# EAGLE design msnanopcb (EAGLE 7.7.0)
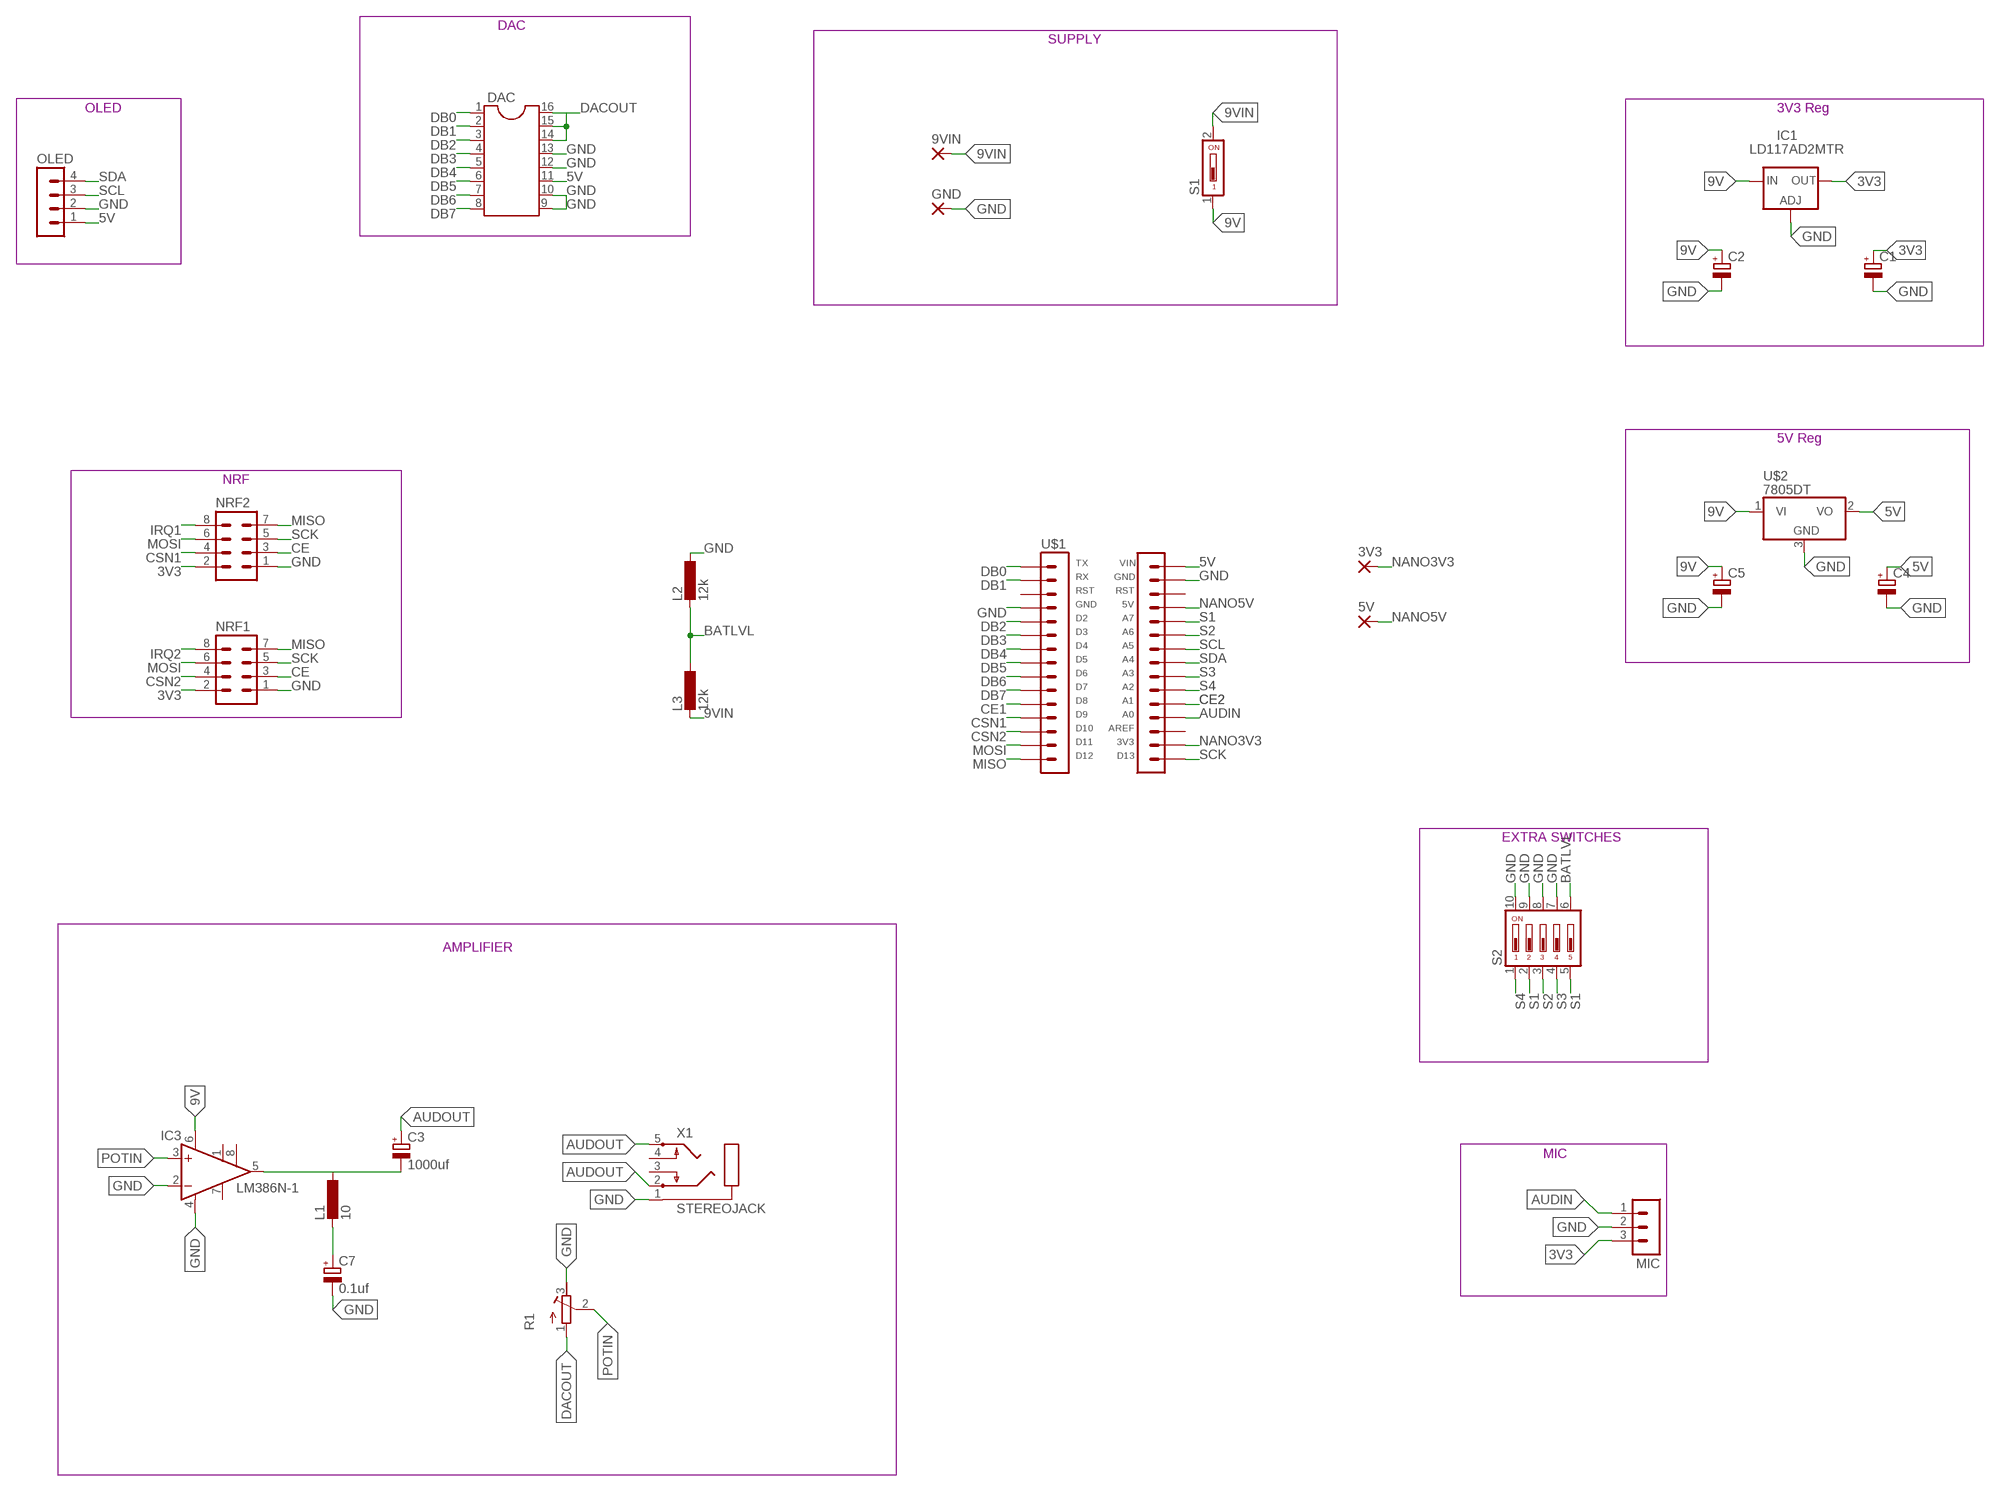
[diagram p0: schematic, sheet 1]

## Parts
3V3  WIREPADSMD1,27-254  [SMD1,27-2,54]
5V  WIREPADSMD1,27-254  [SMD1,27-2,54]
9VIN  WIREPADSMD1,27-254  [SMD1,27-2,54]
C1  CPOL-EUE2,5-6E  [E2,5-6E]
C2  CPOL-EUE2,5-6E  [E2,5-6E]
C3  1000uf  CPOL-EUE3.5-8  [E3,5-8]
C4  CPOL-EUE2,5-6E  [E2,5-6E]
C5  CPOL-EUE2,5-6E  [E2,5-6E]
C7  0.1uf  CPOL-EUE2-5  [E2-5]
DAC  DIL16S  [SOCKET-16]
GND  WIREPADSMD1,27-254  [SMD1,27-2,54]
IC1  LD117AD2MTR  [D2PACK]
IC3  LM386N-1  [DIL08]
L1  10  L-EU0204/7  [0204/7]
L2  12k  L-EU0204/7  [0204/7]
L3  12k  L-EU0204/7  [0204/7]
MIC  MA03-1  [MA03-1]
NRF1  MA04-2  [MA04-2]
NRF2  MA04-2  [MA04-2]
OLED  MA04-1  [MA04-1]
R1  R-TRIMM3296P  [RTRIM3296P]
S1  DS01  [DS-01]
S2  DS05  [DS-05]
U$1  ARD-NANO  [ARD-NANO]
U$2  7805DT  [TO252]
X1  STEREOJACK  [STX3100]

## Nets
3V3: C1.+ IC1.2(OUT) MIC.3 NRF1.2 NRF2.2
5V: C4.+ DAC.11 OLED.1 U$1.VIN U$2.2(VO)
9V: C2.+ C5.+ IC1.3(IN) IC3.6(VS) S1.1 U$2.1(VI)
9VIN: 9VIN.1(P) L3.2 S1.2
AUDIN: MIC.1 U$1.A0
AUDOUT: C3.+ X1.2 X1.5
BATLVL: L2.2 L3.1 S2.6
CE: NRF1.3 NRF2.3
CE1: U$1.D8
CE2: U$1.A1
CSN1: NRF2.4 U$1.D9
CSN2: NRF1.4 U$1.D10
DACOUT: DAC.14 DAC.15 DAC.16 R1.1(A)
DB0: DAC.1 U$1.TX
DB1: DAC.2 U$1.RX
DB2: DAC.3 U$1.D2
DB3: DAC.4 U$1.D3
DB4: DAC.5 U$1.D4
DB5: DAC.6 U$1.D5
DB6: DAC.7 U$1.D6
DB7: DAC.8 U$1.D7
GND: C1.- C2.- C4.- C5.- C7.- DAC.9 DAC.10 DAC.12 DAC.13 GND.1(P) IC1.1(ADJ) IC3.2(-IN) IC3.4(GND) L2.1 MIC.2 NRF1.1 NRF2.1 OLED.2 R1.3(E) S2.7 S2.8 S2.9 S2.10 U$1.GND1 U$1.GND2 U$2.3(GND) X1.1
IRQ1: NRF2.8
IRQ2: NRF1.8
MISO: NRF1.7 NRF2.7 U$1.D12
MOSI: NRF1.6 NRF2.6 U$1.D11
N$4: C3.- IC3.5(OUT) L1.1
N$9: C7.+ L1.2
NANO3V3: 3V3.1(P) U$1.3V3
NANO5V: 5V.1(P) U$1.5V
POTIN: IC3.3(+IN) R1.2(S)
S1: S2.2 S2.5 U$1.A7
S2: S2.3 U$1.A6
S3: S2.4 U$1.A3
S4: S2.1 U$1.A2
SCK: NRF1.5 NRF2.5 U$1.D13
SCL: OLED.3 U$1.A5
SDA: OLED.4 U$1.A4
Unconnected: IC3.1(GAIN) IC3.7(BYPASS) IC3.8(GAIN) U$1.AREF U$1.RST1 U$1.RST2 X1.3 X1.4

## Notes on the sheet
- DAC
- SUPPLY
- OLED | 3V3 Reg
- 5V Reg
- NRF
- EXTRA SWITCHES
- AMPLIFIER
- MIC

## Library data of the parts
3V3 5V 9VIN GND = wirepad:WIREPAD: Wire PAD connect wire on PCB
C1-C5 C7 = rcl:CPOL-EU: POLARIZED CAPACITOR, European symbol
DAC = ic-package:DIL16: Dual In Line / Socket
IC1 = v-reg:LD117A?*: Low drop fixed and adjustable positive voltage regulators 1 A Source: http://www.st.com/stonline/products/literature/ds/7194/ld1117axx.pdf
IC3 = linear:LM386?-*: Low Voltage Audio Power Amplifier Source: http://cache.national.com/ds/LM/LM386.pdf
L1-L3 = rcl:L-EU: INDUCTOR, European symbol
MIC = 00-con-lstb_edited:MA03-1: PIN HEADER; OC_FARNELL: unknown; OC_NEWARK: unknown
NRF1 NRF2 = con-lstb:MA04-2: PIN HEADER; OC_FARNELL: unknown; OC_NEWARK: unknown
OLED = con-lstb:MA04-1: PIN HEADER; OC_FARNELL: unknown; OC_NEWARK: unknown
R1 = rcl:R-TRIMM: Trimm resistor
S1 = switch-dil:DS01: DIL/CODE SWITCH; OC_FARNELL: unknown; OC_NEWARK: unknown
S2 = switch-dil:DS05: DIL/CODE SWITCH; OC_FARNELL: 1255225; OC_NEWARK: unknown
U$1 = #rcn-15:ARD-NANO
U$2 = adafruit:78*: Positive VOLTAGE REGULATOR Added bigger pads to the TO-92 package
X1 = adafruit:STEREOJACK: MIC/HEADPHONE JACK Stereo jack with two switches. Kycon STX3100, CUI SJ1-3555NG and/or 4UCon 05544

## Board
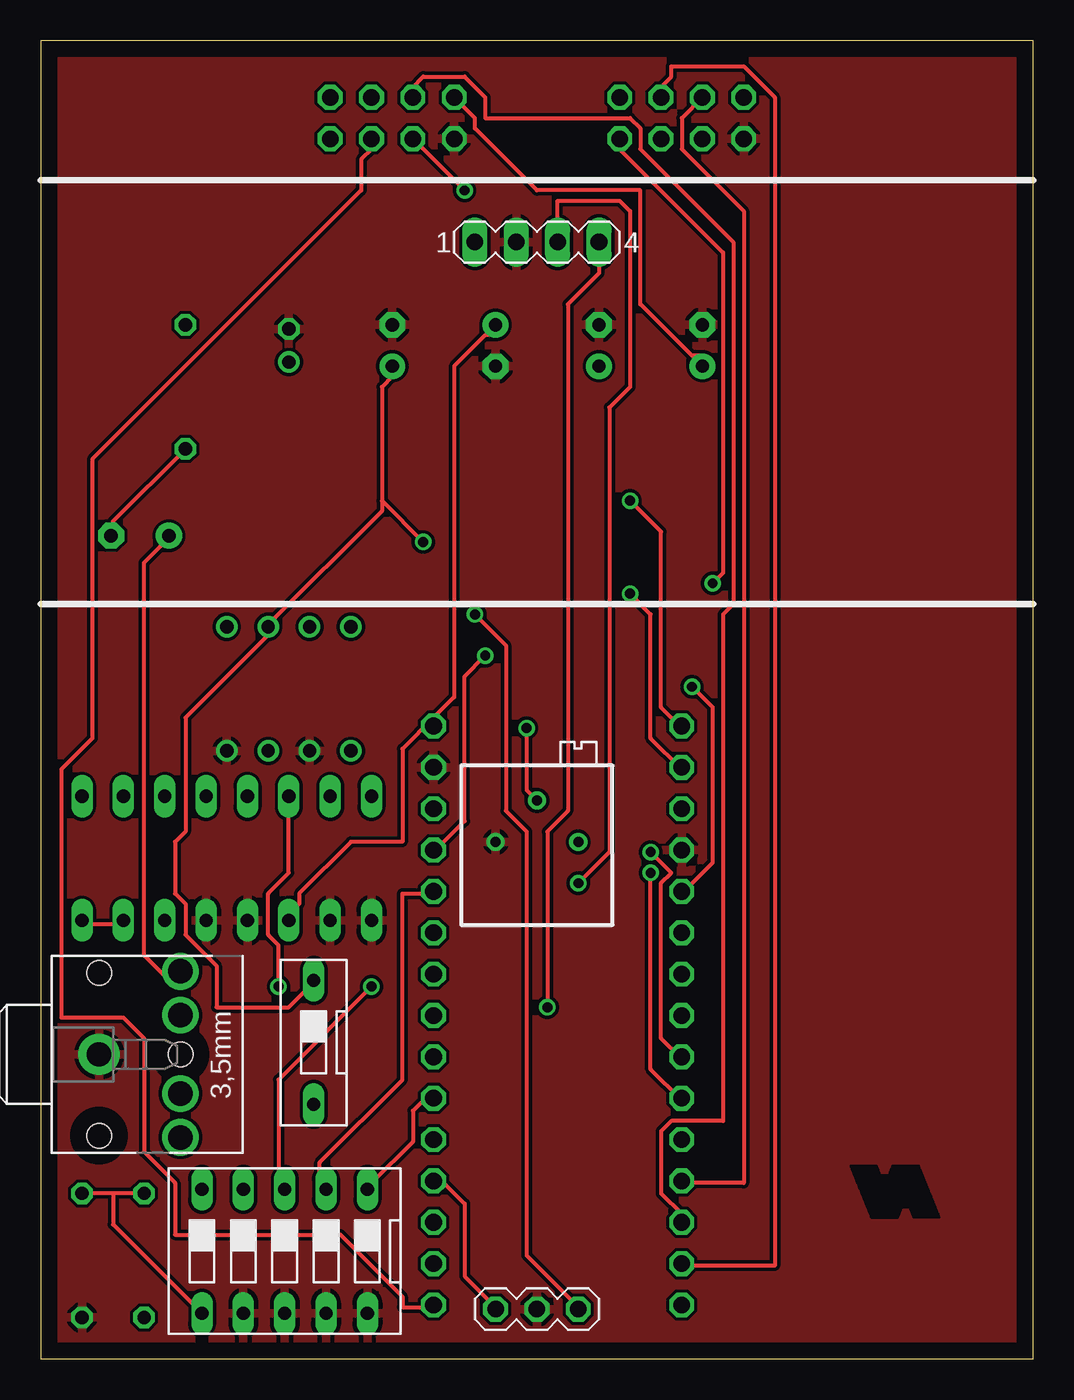
[diagram p1: board, top side]
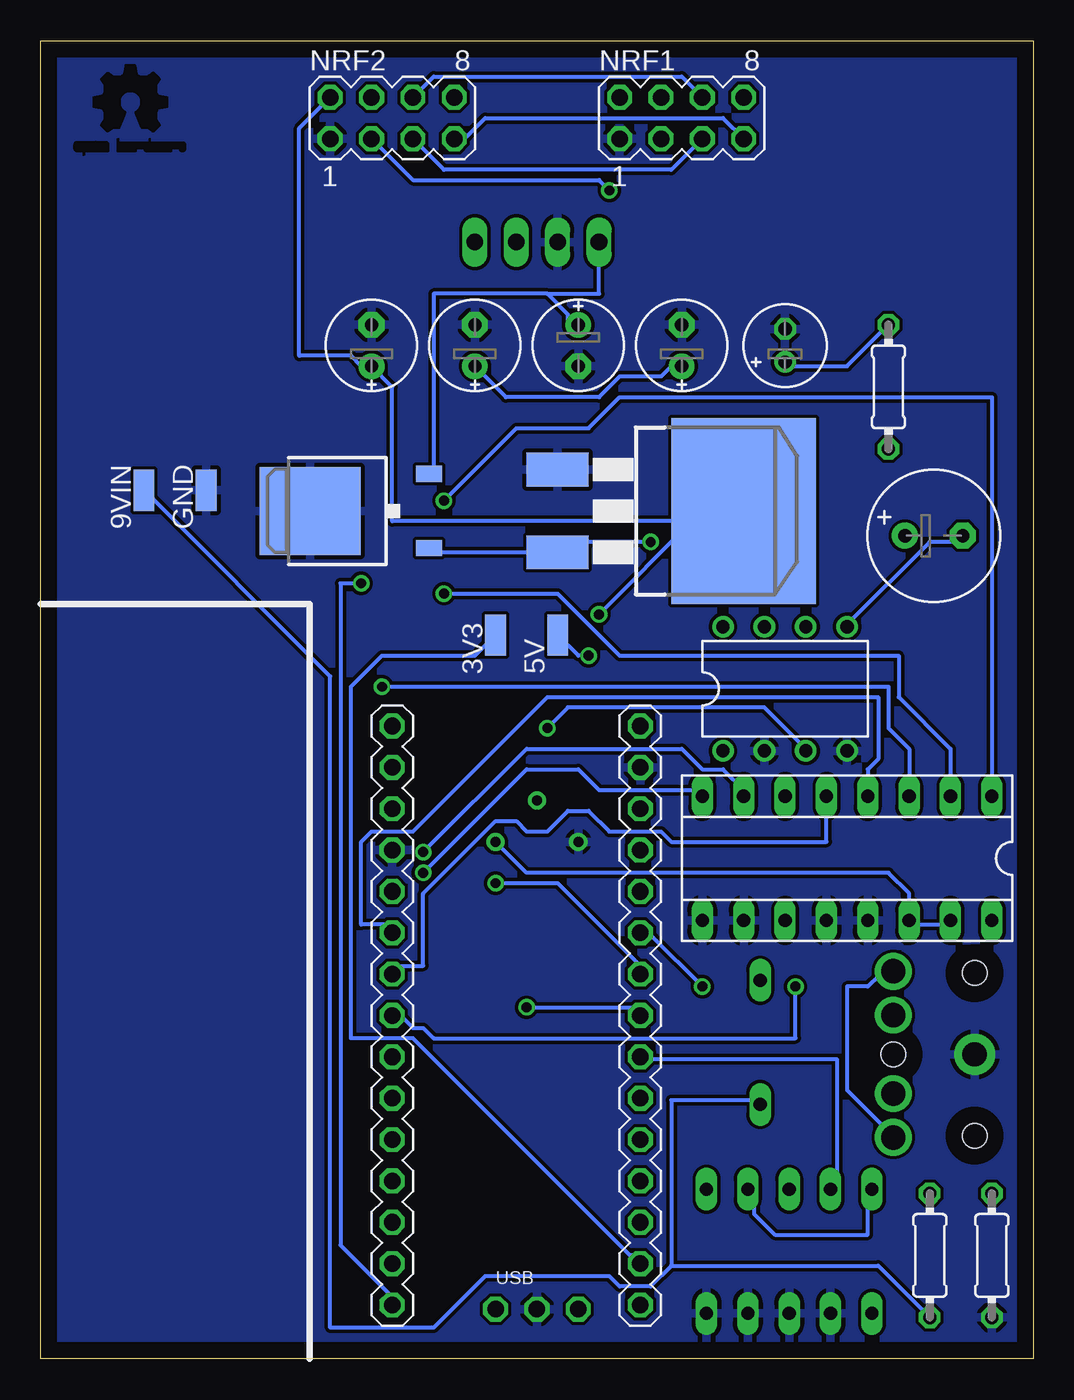
[diagram p2: board, bottom side, seen from below]

Size 60.96 x 80.95 mm. Coordinates in mm from the lower left corner, seen from the top.
Outline: 0,0 60.96,0 60.96,80.95 0,80.95 0,0
Copper layers (1*16): Top 0.035mm / dielectric 1.5mm / Bottom 0.035mm
Design rules "default": minimum track width 10mil, minimum drill 24mil, track to track 8mil, track to pad 8mil, pad to pad 8mil, via to via 8mil, smd to smd 8mil, copper to edge 40mil, drill to drill 8mil, minimum pad ring 10mil, minimum via ring 8mil, stop-mask expansion 4mil, vias tented up to drill 0mil, thermal gap 10mil
tRestrict: area 55.2,8.6 to 55.3,8.7; area 55.2,8.6 to 55.2,8.8; area 55.2,8.6 to 55.2,8.9; area 55.2,8.6 to 55.2,8.9; area 55.1,8.6 to 55.2,9; area 55.1,8.6 to 55.1,9; area 55.1,8.6 to 55.1,9.1; area 55.1,8.6 to 55.1,9.2; area 55,8.6 to 55.1,9.2; area 55,8.6 to 55,8.8; area 55,8.8 to 55,9.3; area 55,8.6 to 55,8.8; 484 more areas
bRestrict: area 58.3,73.9 to 58.4,73.9; area 58.3,73.9 to 58.4,73.9; area 58.3,73.9 to 58.4,73.9; area 58.3,73.9 to 58.4,73.9; area 58.3,73.9 to 58.4,73.9; area 58.3,73.9 to 58.4,73.9; area 58.3,73.9 to 58.4,73.9; area 58.3,73.9 to 58.4,73.9; area 58.3,73.9 to 58.4,73.9; area 58.3,73.9 to 58.4,73.9; area 58.3,73.9 to 58.4,73.9; area 58.3,73.9 to 58.4,73.9; 7412 more areas

### Footprints (pad centres in the part's own frame; a part is rotated, then mirrored left to right if it is on the bottom)
SMD1,27-2,54 = smd 1.27 x 2.54: 1 0,0
E2,5-6E = drill 0.813 pad 1.575: + -1.27,0 | drill 0.813 pad 1.575 octagon: - 1.27,0
E3,5-8 = drill 0.813 pad 1.6: + -1.778,0 | drill 0.813 pad 1.6 octagon: - 1.778,0
E2-5 = drill 0.813 pad 1.27: + -1.016,0 | drill 0.813 pad 1.27 octagon: - 1.016,0
SOCKET-16 = drill 0.813 long: 1 -8.89,-3.81; 2 -6.35,-3.81; 3 -3.81,-3.81; 4 -1.27,-3.81; 5 1.27,-3.81; 6 3.81,-3.81; 7 6.35,-3.81; 8 8.89,-3.81; 9 8.89,3.81; 10 6.35,3.81; 11 3.81,3.81; 12 1.27,3.81; 13 -1.27,3.81; 14 -3.81,3.81; 15 -6.35,3.81; 16 -8.89,3.81
D2PACK = smd 2.083 x 3.81: 1 -2.54,-8.89; 3 2.54,-8.89 | smd 11.43 x 8.89: 2 0,2.54
DIL08 = drill 0.813 pad 1.27: 1 -3.81,-3.81; 2 -1.27,-3.81; 3 1.27,-3.81; 4 3.81,-3.81; 5 3.81,3.81; 6 1.27,3.81; 7 -1.27,3.81; 8 -3.81,3.81
0204/7 = drill 0.813 octagon: 1 -3.81,0; 2 3.81,0
MA03-1 = drill 1.016 octagon: 1 -2.54,0; 2 0,0; 3 2.54,0
MA04-2 = drill 1.016 octagon: 1 -3.81,-1.27; 2 -3.81,1.27; 3 -1.27,-1.27; 4 -1.27,1.27; 5 1.27,-1.27; 6 1.27,1.27; 7 3.81,-1.27; 8 3.81,1.27
MA04-1 = drill 1.016 long: 1 -3.81,0; 2 -1.27,0; 3 1.27,0; 4 3.81,0
RTRIM3296P = drill 0.61: 1 0,-2.54; 2 2.54,0; 3 0,2.54
DS-01 = drill 0.813 long: 1 0,-3.81; 2 0,3.81
DS-05 = drill 0.813 long: 1 -5.08,-3.81; 2 -2.54,-3.81; 3 0,-3.81; 4 2.54,-3.81; 5 5.08,-3.81; 6 5.08,3.81; 7 2.54,3.81; 8 0,3.81; 9 -2.54,3.81; 10 -5.08,3.81
ARD-NANO = drill 1.016 octagon: 3V3 7.62,-15.24; 5V 7.62,10.16; A0 7.62,-10.16; A1 7.62,-7.62; A2 7.62,-5.08; A3 7.62,-2.54; A4 7.62,0; A5 7.62,2.54; A6 7.62,5.08; A7 7.62,7.62; AREF 7.62,-12.7; D2 -7.62,7.62; D3 -7.62,5.08; D4 -7.62,2.54; D5 -7.62,0; D6 -7.62,-2.54; D7 -7.62,-5.08; D8 -7.62,-7.62; D9 -7.62,-10.16; D10 -7.62,-12.7; D11 -7.62,-15.24; D12 -7.62,-17.78; D13 7.62,-17.78; GND1 -7.62,10.16; GND2 7.62,15.24; RST1 -7.62,12.7; RST2 7.62,12.7; RX -7.62,15.24; TX -7.62,17.78; VIN 7.62,17.78
TO252 = smd 1 x 1.6: 1 -2.28,-4.8; 2 2.28,-4.8 | smd 5.4 x 6.2: 3 0,2.5
STX3100 = drill 1.5 pad 2.54: 1 2.7,-0.1 | drill 1.5: 2 7.7,5; 3 7.7,2.3; 4 7.7,-2.5; 5 7.7,-5.2 | hole 1.5: 2.7,4.9; 2.7,-5.1; 7.7,-0.1

### Placement (x,y rotation side)
3V3  33.02,44.45 0 bottom
5V  29.21,44.45 0 bottom
9VIN  54.61,53.34 0 bottom
C1  40.64,62.23 90 bottom
C2  34.29,62.23 90 bottom
C3  6.1,50.55 0 bottom
C4  27.94,62.23 270 bottom
C5  21.59,62.23 90 bottom
C7  15.24,62.23 90 bottom
DAC  11.43,30.73 180 bottom
GND  50.8,53.34 0 bottom
IC1  20.32,52.07 270 bottom
IC3  15.24,41.15 0 bottom
L1  8.89,59.69 90 bottom
L2  2.54,6.35 90 bottom
L3  6.35,6.35 270 bottom
MIC  30.48,3.05 0 top
NRF1  21.59,76.2 0 bottom
NRF2  39.37,76.2 0 bottom
OLED  30.48,68.58 0 top
R1  30.48,31.75 90 top
S1  16.76,19.43 180 top
S2  14.99,6.6 180 top
U$1  31.75,21.08 0 bottom
U$2  41.91,52.07 90 bottom
X1  0.89,18.8 0 top

### Tracks (layer width: path | path; a pad name or v marks a point on that pad's centre or on a via)
3V3  (via drill 0.61)
  Top 0.254: NRF1.2 26.67,76.2 26.67,75.56 30.48,71.75 36.83,71.75 36.83,64.77 40.01,61.59 40.64,61.59 C1.+ | v26.67,45.72 28.57,43.81 28.57,33.66 29.84,32.38 29.84,6.35 33.02,3.17 MIC.3
  Bottom 0.254: NRF2.2 45.09,75.56 45.09,61.59 41.91,61.59 41.27,60.96 C1.+ 39.37,59.69 39.37,51.44 20.95,51.44 | 20.95,51.44 20.32,52.07 IC1.2 20.95,51.44 | 20.95,51.44 v26.67,45.72
5V
  Top 0.254: 24.13,39.37 22.23,37.47 22.23,31.75 19.05,31.75 15.88,28.57 15.88,27.94 15.24,27.3 DAC.11 | 24.13,39.37 25.4,40.64 25.4,60.96 27.3,62.87 27.94,62.87 C4.+ | 24.13,39.37 U$1.VIN
  Bottom 0.254: 29.84,65.41 36.83,65.41 36.83,54.61 U$2.2 | 29.84,65.41 28.57,64.14 28.57,63.5 C4.+ | OLED.1 26.67,65.41 29.84,65.41
9V  (via drill 0.61)
  Top 0.254: 20.95,52.7 20.95,59.69 21.59,60.33 C5.+ | 20.95,52.7 20.95,52.07 13.97,45.09 IC3.6 13.97,44.45 8.89,39.37 8.89,32.38 8.26,31.75 8.26,28.57 8.89,27.94 8.89,26.04 10.79,24.13 10.79,21.59 15.24,21.59 16.51,22.86 S1.1 | 20.95,52.7 v23.5,50.16
  Bottom 0.254: U$2.1 36.83,49.53 IC1.3 28.57,50.16 v23.5,50.16 | C2.+ 32.38,59.05 26.67,59.05 25.4,60.33 22.86,60.33 22.23,60.96 C5.+
9VIN
  Bottom 0.254: 9VIN.1 43.18,41.91 43.18,1.91 36.83,1.91 33.66,5.08 26.04,5.08 25.4,4.45 23.5,4.45 22.23,5.71 | 22.23,5.71 22.23,15.88 17.14,15.88 S1.2 | L3.2 9.53,5.71 22.23,5.71
AUDIN
  Top 0.254: MIC.1 27.94,3.17 26.04,5.08 26.04,9.53 24.13,11.43 U$1.A0
AUDOUT
  Top 0.254: C3.+ 7.62,50.16 6.35,48.9 6.35,24.77 8.26,22.86 8.89,22.86 8.89,23.5 X1.2
  Bottom 0.254: X1.5 8.89,13.97 11.43,16.51 11.43,22.86 10.16,22.86 9.53,23.5 8.89,23.5 X1.2
BATLVL
  Top 0.254: L3.1 4.45,10.16 | 4.45,10.16 L2.2 | S2.6 4.45,8.26 4.45,10.16
CE  (via drill 0.61)
  Top 0.254: v26.04,71.75 NRF1.3
  Bottom 0.254: v26.04,71.75 26.67,72.39 38.1,72.39 NRF2.3
CSN1
  Top 0.254: NRF2.4 39.37,76.2 39.37,74.3 43.18,70.48 43.18,10.79 39.37,10.79 U$1.D9
CSN2
  Top 0.254: NRF1.4 22.86,78.11 23.5,78.74 26.04,78.74 27.3,77.47 27.3,76.2 36.2,76.2 36.83,75.56 36.83,74.3 42.55,68.58 42.55,46.35 41.91,45.72 41.91,14.61 38.73,14.61 38.1,13.97 38.1,10.16 39.37,8.89 U$1.D10
DACOUT
  Top 0.254: DAC.16 2.54,26.67 5.08,26.67 DAC.15
  Bottom 0.254: R1.1 31.11,29.84 8.89,29.84 7.62,28.57 DAC.14 7.62,26.67 5.08,26.67 DAC.15
DB0  (via drill 0.61)
  Top 0.254: v36.2,52.7 38.1,50.8 38.1,40.01 39.37,38.73 U$1.TX
  Bottom 0.254: DAC.1 2.54,59.05 25.4,59.05 27.3,57.15 31.75,57.15 v36.2,52.7
DB1  (via drill 0.61)
  Top 0.254: v36.2,46.99 37.47,45.72 37.47,38.1 39.37,36.2 U$1.RX
  Bottom 0.254: DAC.2 5.08,37.47 8.26,40.64 8.26,43.18 25.4,43.18 29.21,46.99 v36.2,46.99
DB2  (via drill 0.61)
  Top 0.254: v40.01,41.27 41.27,40.01 41.27,30.48 39.37,28.57 U$1.D2
  Bottom 0.254: DAC.3 7.62,37.47 8.89,38.73 8.89,41.27 v40.01,41.27
DB3
  Bottom 0.254: DAC.4 10.16,36.2 9.53,36.83 9.53,40.64 29.84,40.64 38.1,32.38 40.64,32.38 41.27,31.75 41.27,26.67 39.37,26.67 U$1.D3
DB4
  Bottom 0.254: DAC.5 12.7,31.75 22.23,31.75 22.86,32.38 26.04,32.38 27.3,33.66 28.57,33.66 29.84,32.38 31.11,32.38 31.75,33.02 33.02,33.02 37.47,28.57 37.47,24.13 39.37,24.13 U$1.D4
DB5  (via drill 0.61)
  Top 0.254: DAC.6 15.24,29.84 13.97,28.57 13.97,26.04 14.61,25.4 v14.61,22.86
  Bottom 0.254: v14.61,22.86 14.61,19.68 36.83,19.68 37.47,20.32 38.1,20.32 38.73,20.95 39.37,20.95 U$1.D5
DB6  (via drill 0.61)
  Top 0.254: v37.47,31.11 38.73,29.84 38.1,29.21 38.1,19.68 39.37,18.41 U$1.D6
  Bottom 0.254: v37.47,31.11 31.11,37.47 21.59,37.47 20.32,36.2 19.05,36.2 17.78,34.92 DAC.7
DB7  (via drill 0.61)
  Top 0.254: v37.47,29.84 37.47,17.78 39.37,15.88 U$1.D7
  Bottom 0.254: v37.47,29.84 31.11,36.2 27.94,36.2 26.67,34.92 20.32,34.92 DAC.8
GND
  pour Top: 0,80.95 60.96,80.95 60.96,0 0,0
  pour Bottom: 0,80.95 60.96,80.95 60.96,0 0,0
MISO  (via drill 0.61)
  Top 0.254: v41.27,47.62 41.91,48.26 41.91,67.94 35.56,74.3 NRF2.7
  Bottom 0.254: NRF1.7 19.05,76.2 33.66,76.2 34.92,74.93 NRF2.7 | v41.27,47.62 42.55,47.62 42.55,6.99 39.37,3.81 U$1.D12
MOSI
  Top 0.254: NRF2.6 38.1,78.11 38.73,78.74 38.73,79.38 43.18,79.38 45.09,77.47 45.09,5.71 39.37,5.71 U$1.D11
  Bottom 0.254: NRF1.6 21.59,78.74 36.83,78.74 NRF2.6
N$4
  Top 0.254: L1.1 4.45,51.44 4.45,50.8 C3.-
  Bottom 0.254: IC3.5 11.43,45.09 6.35,50.16 4.45,50.16 C3.-
N$9
  Bottom 0.254: L1.2 11.43,60.96 15.24,60.96 C7.+
NANO3V3
  Bottom 0.254: 3V3.1 34.29,43.18 40.01,43.18 41.91,41.27 41.91,19.68 38.1,19.68 24.77,6.35 24.13,6.35 U$1.3V3
NANO5V  (via drill 0.61)
  Top 0.254: v27.3,43.18 26.04,41.91 26.04,33.02 24.13,31.11 U$1.5V
  Bottom 0.254: 5V.1 27.94,43.18 v27.3,43.18
POTIN  (via drill 0.61)
  Top 0.254: R1.2 29.84,34.92 v29.84,38.73
  Bottom 0.254: v29.84,38.73 28.57,40.01 16.51,40.01 13.97,37.47 IC3.3
S1
  Top 0.254: U$1.A7 24.13,28.57 22.23,28.57 22.23,17.14 17.14,12.06 17.14,10.79 S2.2
  Bottom 0.254: S2.5 10.16,10.16 10.16,7.62 15.88,7.62 17.14,8.89 17.14,10.16 S2.2
S2  (via drill 0.61)
  Top 0.254: v20.32,22.86 14.61,17.14 14.61,10.79 S2.3
  Bottom 0.254: v20.32,22.86 23.5,26.04 24.13,26.04 U$1.A6
S3
  Bottom 0.254: S2.4 12.06,10.79 12.06,18.41 24.13,18.41 U$1.A3
S4
  Top 0.254: S2.1 20.32,10.79 22.86,13.34 22.86,15.24 24.13,16.51 U$1.A2
SCK
  Top 0.254: NRF1.5 20.32,74.3 19.68,73.66 19.68,71.75 3.17,55.24 3.17,38.1 1.27,36.2 1.27,20.95 5.08,20.95 6.35,19.68 6.35,12.7 8.26,10.79 8.26,7.62 18.41,7.62 22.23,3.81 22.23,3.17 24.13,3.17 U$1.D13
  Bottom 0.254: NRF2.5 36.2,73.03 22.23,73.03 NRF1.5
SCL  (via drill 0.61)
  Top 0.254: v33.02,29.21 34.92,31.11 34.92,58.42 36.2,59.69 36.2,70.48 35.56,71.12 31.75,71.12 OLED.3
  Bottom 0.254: v33.02,29.21 29.21,29.21 24.13,24.13 U$1.A5
SDA  (via drill 0.61)
  Top 0.254: v31.11,21.59 31.11,32.38 32.38,33.66 32.38,64.77 34.29,66.67 OLED.4
  Bottom 0.254: v31.11,21.59 24.13,21.59 U$1.A4

### Text on the board
tRestrict: APHYRE 1.0